# EAGLE design boilup_v1 (EAGLE 8.7.1)
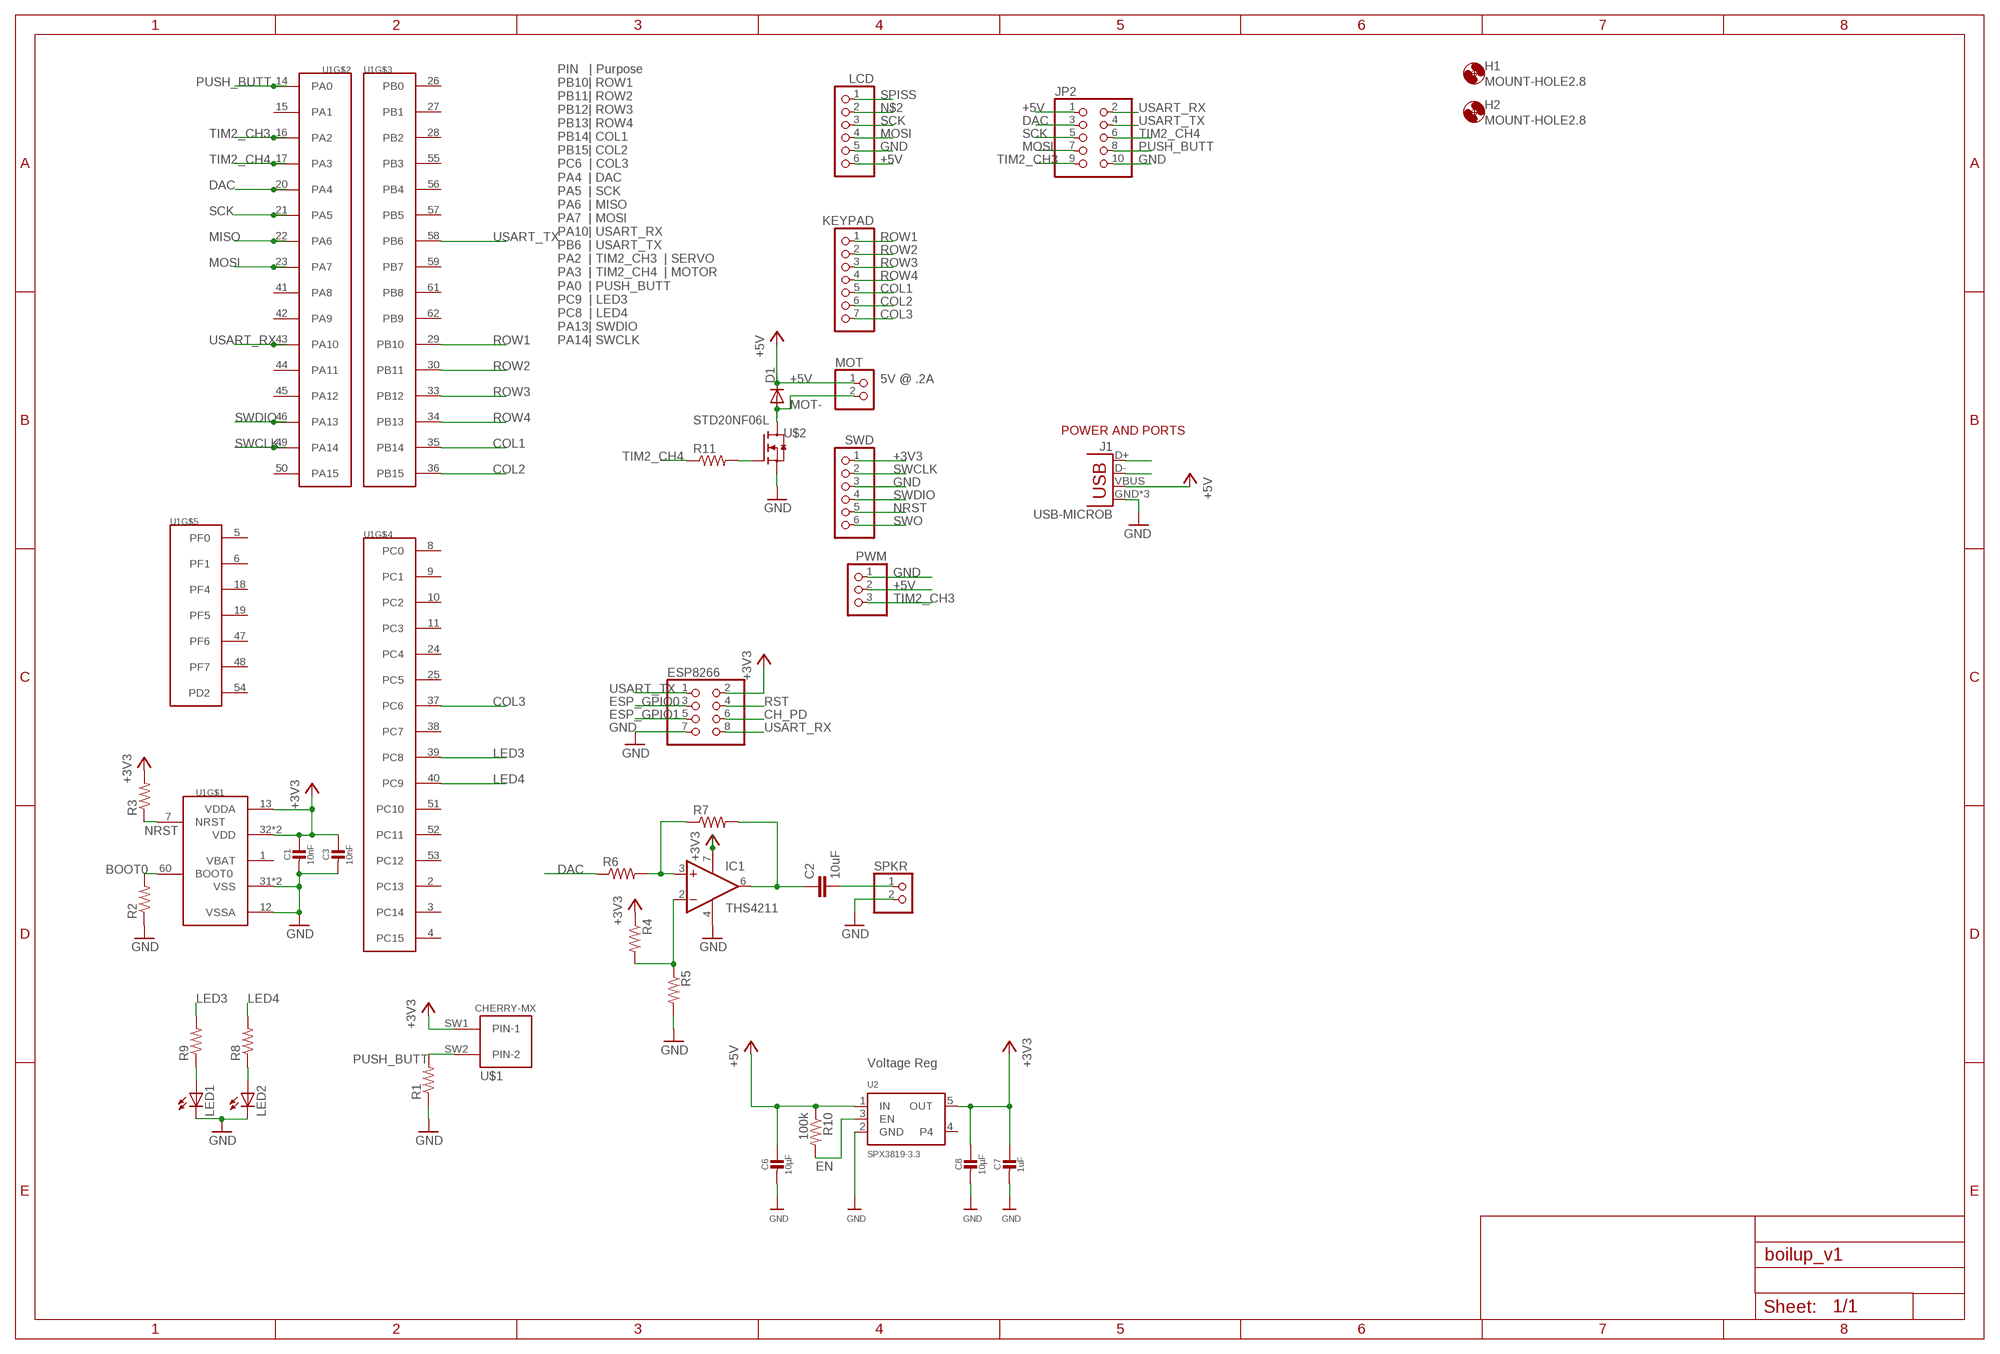
[diagram p0: schematic, sheet 1]

## Parts
C1  10nF  CAP_CERAMIC0805-NOOUTLINE  [0805-NO]
C2  10uF  C-EUC0603K  [C0603K]
C3  10nF  CAP_CERAMIC0805-NOOUTLINE  [0805-NO]
C6  10µF  CAP_CERAMIC0805-NOOUTLINE  [0805-NO]
C7  1uF  CAP_CERAMIC0603_NO  [0603-NO]
C8  10µF  CAP_CERAMIC0805-NOOUTLINE  [0805-NO]
D1  DIODE-DO-214AC  [DO-214AC]
ESP8266  PINHD-2X4  [2X04]
H1  MOUNT-HOLE2.8  [2,8]
H2  MOUNT-HOLE2.8  [2,8]
IC1  THS4211  [S-PDSO-G08]
J1  USB-MICROB  [USB-MICROB]
JP2  PINHD-2X5  [2X05]
KEYPAD  PINHD-1X7  [1X07]
LCD  PINHD-1X6  [1X06]
LED1  LEDSML0805  [SML0805]
LED2  LEDSML0805  [SML0805]
MOT  PINHD-1X2  [1X02]
PWM  PINHD-1X3  [1X03]
R1  R-US_R0603  [R0603]
R2  R-US_R0603  [R0603]
R3  R-US_R0603  [R0603]
R4  R-US_R0603  [R0603]
R5  R-US_R0603  [R0603]
R6  R-US_R0603  [R0603]
R7  R-US_R0603  [R0603]
R8  R-US_R0603  [R0603]
R9  R-US_R0603  [R0603]
R10  100k  R-US_R0603  [R0603]
R11  R-US_R0603  [R0603]
SPKR  PINHD-1X2  [1X02]
SWD  PINHD-1X6  [1X06]
U1  STM32F0_LQFP64  [QFP50P1200X1200X160-64N]
U2  SPX3819-3.3  VREG_SOT23-5  [SOT23-5]
U$1  CHERRY-MX  [CHERRY-MX]
U$2  STD20NF06L  [DPAK]

## Nets
+3V3: C1.1 C3.1 C7.1 C8.1 ESP8266.2 IC1.7(V+) R3.2 R4.1 SWD.1 U1.13(VDDA) U1.32(VDD) U1.64(VDD) U2.5(OUT) U$1.SW1(PIN-1)
+5V: C6.1 D1.C J1.VBUS JP2.1 LCD.6 MOT.1 PWM.2 R10.1 U2.1(IN)
AMP: IC1.3(+IN) R6.2 R7.1
BOOT0: R2.2 U1.60(BOOT0)
CH_PD: ESP8266.6
COL1: KEYPAD.5 U1.35(PB14)
COL2: KEYPAD.6 U1.36(PB15)
COL3: KEYPAD.7 U1.37(PC6)
D+: J1.D+
D-: J1.D-
DAC: JP2.3 R6.1 U1.20(PA4)
EN: R10.2 U2.3(EN)
ESP_GPIO0: ESP8266.3
ESP_GPIO1: ESP8266.5
GND: C1.2 C3.2 C6.2 C7.2 C8.2 ESP8266.7 IC1.4(V-) J1.GND J1.MT1(GND) J1.MT2(GND) JP2.10 LCD.5 LED1.C LED2.C PWM.1 R1.1 R2.1 R5.2 SPKR.2 SWD.3 U1.12(VSSA) U1.31(VSS) U1.63(VSS) U2.2(GND) U$2.P$2(S)
LED3: R9.2 U1.39(PC8)
LED4: R8.2 U1.40(PC9)
MISO: U1.22(PA6)
MOSI: JP2.7 LCD.4 U1.23(PA7)
MOT-: D1.A MOT.2 U$2.P$1(D)
N$1: LED2.A R8.1
N$2: LCD.2
N$3: LED1.A R9.1
N$4: R11.2 U$2.P$3(G)
N$7: IC1.2(-IN) R4.2 R5.1
N$16: C2.2 SPKR.1
N$17: C2.1 IC1.6(OUT) R7.2
NRST: R3.1 SWD.5 U1.7(NRST)
PUSH_BUTT: JP2.8 R1.2 U1.14(PA0) U$1.SW2(PIN-2)
ROW1: KEYPAD.1 U1.29(PB10)
ROW2: KEYPAD.2 U1.30(PB11)
ROW3: KEYPAD.3 U1.33(PB12)
ROW4: KEYPAD.4 U1.34(PB13)
RST: ESP8266.4
SCK: JP2.5 LCD.3 U1.21(PA5)
SPISS: LCD.1
SWCLK: SWD.2 U1.49(PA14)
SWDIO: SWD.4 U1.46(PA13)
SWO: SWD.6
TIM2_CH3: JP2.9 PWM.3 U1.16(PA2)
TIM2_CH4: JP2.6 R11.1 U1.17(PA3)
USART_RX: ESP8266.8 JP2.2 U1.43(PA10)
USART_TX: ESP8266.1 JP2.4 U1.58(PB6)
Unconnected: IC1.TH U1.1(VBAT) U1.2(PC13) U1.3(PC14) U1.4(PC15) U1.5(PF0) U1.6(PF1) U1.8(PC0) U1.9(PC1) U1.10(PC2) U1.11(PC3) U1.15(PA1) U1.18(PF4) U1.19(PF5) U1.24(PC4) U1.25(PC5) U1.26(PB0) U1.27(PB1) U1.28(PB2) U1.38(PC7) U1.41(PA8) U1.42(PA9) U1.44(PA11) U1.45(PA12) U1.47(PF6) U1.48(PF7) U1.50(PA15) U1.51(PC10) U1.52(PC11) U1.53(PC12) U1.54(PD2) U1.55(PB3) U1.56(PB4) U1.57(PB5) U1.59(PB7) U1.61(PB8) U1.62(PB9) U2.4

## Notes on the sheet
- PIN   | Purpose
  PB10| ROW1
  PB11| ROW2
  PB12| ROW3
  PB13| ROW4
  PB14| COL1
  PB15| COL2
  PC6  | COL3
  PA4  | DAC
  PA5  | SCK
  PA6  | MISO
  PA7  | MOSI
  PA10| USART_RX
  PB6  | USART_TX
  PA2  | TIM2_CH3  | SERVO
  PA3  | TIM2_CH4  | MOTOR
  PA0  | PUSH_BUTT
  PC9  | LED3
  PC8  | LED4
  PA13| SWDIO
  PA14| SWCLK
- 5V @ .2A
- POWER AND PORTS
- Voltage Reg

## Library data of the parts
C1 C3 C6-C8 = microbuilder:CAP_CERAMIC: Ceramic Capacitors For new designs, use the packages preceded by an '_' character since they are more reliable: The following footprints should be used on most boards: _0402 - Standard footprint for regular board layouts _0603 - Standard footprint for regular board layouts _0805 - Standard footprint for regular board layouts _1206 - Standard footprint for regular board layouts For extremely tight-pitch boards where space is at a premium, the following 'micro-pitch' footprints can be used (smaller pads, no silkscreen outline, etc.): _0402MP - Micro-pitch footprint for very dense/compact boards _0603MP - Micro-pitch footprint for very dense/compact boards _0805MP - Micro-pitch footprint for very dense/compact boards _1206MP - Micro-pitch footprint for very dense/compact boards
C2 = resistor:C-EU: CAPACITOR, European symbol
D1 = diode:DIODE-: DIODE
ESP8266 = pinhead:PINHD-2X4: PIN HEADER
H1 H2 = holes:MOUNT-HOLE: MOUNTING HOLE with drill center marker
IC1 = texas:THS4211: LOW-DISTORTION, HIGH-SPEED, VOLTAGE FEEDBACK AMPLIFIER Source: http://focus.ti.com/lit/ds/symlink/ths4211.pdf; MF: TEXAS INSTRUMENT CONNECTORS; MPN: THS4211DGK; OC_FARNELL: 8453306; OC_NEWARK: 95H4489
J1 = SparkFun-Connectors:USB: USB Connectors USB-B-PTH is fully proven SKU : PRT-00139/CONN-08278 USB-miniB is fully proven SKU : PRT-00587 USB-A-PCB is untested. USB-A-H is throughly reviewed, but untested. Spark Fun Electronics SKU : PRT-00437 USB-B-SMT is throughly reviewed, but untested. Needs silkscreen touching up. USB-A-S has not been used/tested USB-MB-H has not been used/tested USB-MICROB has been used. CONN-09505; PROD_ID: CONN-09505
JP2 = pinhead:PINHD-2X5: PIN HEADER
KEYPAD = pinhead:PINHD-1X7: PIN HEADER
LCD SWD = pinhead:PINHD-1X6: PIN HEADER
LED1 LED2 = led:LED: LED OSRAM: - CHIPLED LG R971, LG N971, LY N971, LG Q971, LY Q971, LO R971, LY R971 LH N974, LH R974 LS Q976, LO Q976, LY Q976 LO Q996 - Hyper CHIPLED LW Q18S LB Q993, LB Q99A, LB R99A - SideLED LS A670, LO A670, LY A670, LG A670, LP A670 LB A673, LV A673, LT A673, LW A673 LH A674 LY A675 LS A676, LA A676, LO A676, LY A676, LW A676 LS A679, LY A679, LG A679 - Hyper Micro SIDELED® LS Y876, LA Y876, LO Y876, LY Y876 LT Y87S - SmartLED LW L88C, LW L88S LB L89C, LB L89S, LG L890 LS L89K, LO L89K, LY L89K LS L896, LA L896, LO L896, LY L896 - TOPLED LS T670, LO T670, LY T670, LG T670, LP T670 LSG T670, LSP T670, LSY T670, LOP T670, LYG T670 LG T671, LOG T671, LSG T671 LB T673, LV T673, LT T673, LW T673 LH T674 LS T676, LA T676, LO T676, LY T676, LB T676, LH T676, LSB T676, LW T676 LB T67C, LV T67C, LT T67C, LS T67K, LO T67K, LY T67K, LW E67C LS E67B, LA E67B, LO E67B, LY E67B, LB E67C, LV E67C, LT E67C LW T67C LS T679, LY T679, LG T679 LS T770, LO T770, LY T770, LG T770, LP T770 LB T773, LV T773, LT T773, LW T773 LH T774 LS E675, LA E675, LY E675, LS T675 LS T776, LA T776, LO T776, LY T776, LB T776 LHGB T686 LT T68C, LB T68C - Hyper Mini TOPLED® LB M676 - Mini TOPLED Santana® LG M470 LS M47K, LO M47K, LY M47K Source: http://www.osram.convergy.de LUXEON: - LUMILED® LXK2-PW12-R00, LXK2-PW12-S00, LXK2-PW14-U00, LXK2-PW14-V00 LXK2-PM12-R00, LXK2-PM12-S00, LXK2-PM14-U00 LXK2-PE12-Q00, LXK2-PE12-R00, LXK2-PE12-S00, LXK2-PE14-T00, LXK2-PE14-U00 LXK2-PB12-K00, LXK2-PB12-L00, LXK2-PB12-M00, LXK2-PB14-N00, LXK2-PB14-P00, LXK2-PB14-Q00 LXK2-PR12-L00, LXK2-PR12-M00, LXK2-PR14-Q00, LXK2-PR14-R00 LXK2-PD12-Q00, LXK2-PD12-R00, LXK2-PD12-S00 LXK2-PH12-R00, LXK2-PH12-S00 LXK2-PL12-P00, LXK2-PL12-Q00, LXK2-PL12-R00 Source: www.luxeon.com KINGBRIGHT: KA-3528ASYC Source: www.kingbright.com
MOT SPKR = pinhead:PINHD-1X2: PIN HEADER
PWM = pinhead:PINHD-1X3: PIN HEADER
R1-R9 R11 = resistor:R-US_: RESISTOR, American symbol
R10 = adafruit:R-US_: RESISTOR, American symbol
U1 = smarttle:STM32F0_LQFP64
U2 = microbuilder:VREG_SOT23-5: SOT23-5 Fixed Voltage Regulators Part Current Out V Out V In V Dropout θJA (°C/W) TJ (°C) Digikey Part No. ADP121 150mA 3.3V 3.4-5.5V 0.09V @ 150mA -- -- ADP121-AUJZ33R7CT-ND ADP121 150mA 3.0V 3.1-5.5V 0.09V @ 150mA -- -- ADP121-AUJZ30R7CT-ND ADP122 300mA 3.3V 3.4-5.5V 0.085V @ 300mA -- -- ADP122AUJZ-3.3-R7CT-ND ADP1712 300mA 3.3V 3.5-5.5V 0.17V @ 300mA -- -- ADP1712AUJZ-3.3-R7TR-ND AP7311 (Low Cost) 150mA 3.3V 3.5-6V 0.15V @ 150mA -- -- AP7311-33WG-7DICT-ND LD39015M18R 150mA 1.8V 1.9V-5.5V 0.08V @ 100mA -- -- 497-6977-1-ND LP2985A-33DBVR 150mA 3.3V 3.3-16V 0.28V @ 150mA 206 150 296-18479-1-ND MCP1824T-3302E/OT 300mA 3.3V 3.5V-6V 0.2V @ 300mA -- -- MCP1824T-3302E/OTCT-ND MIC5205-2.5YM5 TR 150mA 2.5V 2.7-16V 0.165V @ 150mA -- -- 576-1257-2-ND MIC5205-3.0YM5 TR 150mA 3.0V 3.2V-16V 0.165V @ 150mA -- -- 576-1258-2-ND MIC5205-3.3YM5 TR 150mA 3.3V 3.5V-16V 0.165V @ 150mA -- -- 576-1259-2-ND TPS780330220 150mA 3.3V+2.2V 3.6-5.5V 250mV Max -- -- 296-23332-1-ND TDA3663/N1,135 100mA 3.3V 3.5-45V 0.18V @ 50mA -- -- 568-5343-1-ND Max operating temp can be calculated using θJA, TJ (max junction temperature), and power in watts. Set the "Maximum Ambient Temperature" until it reaches TJ ("Max Junction Temperature"), which is the absolute limit for safe use of the regulator: Heat Sink Temperature Calculator <http://www.daycounter.com/Calculators/Heat-Sink-Temperature-Calculator.phtml> For example, With 12V source into a 3.3V LP2985 and a 30mA load, we are dissipating (12V-3.3V) * 0.03A = 0.261W. With a θJA of 206 °C/W, a TJ of 150°C, and 261mW we can safely use the chip without a heat sink up to 75°C (=147.1°C Junction Temperature).
U$1 = cherrymx:CHERRY-MX: Cherry MX series keyswitch
U$2 = smarttle:STD20NF06L

## Module E
Ports: 

### Library data of the parts

## Board
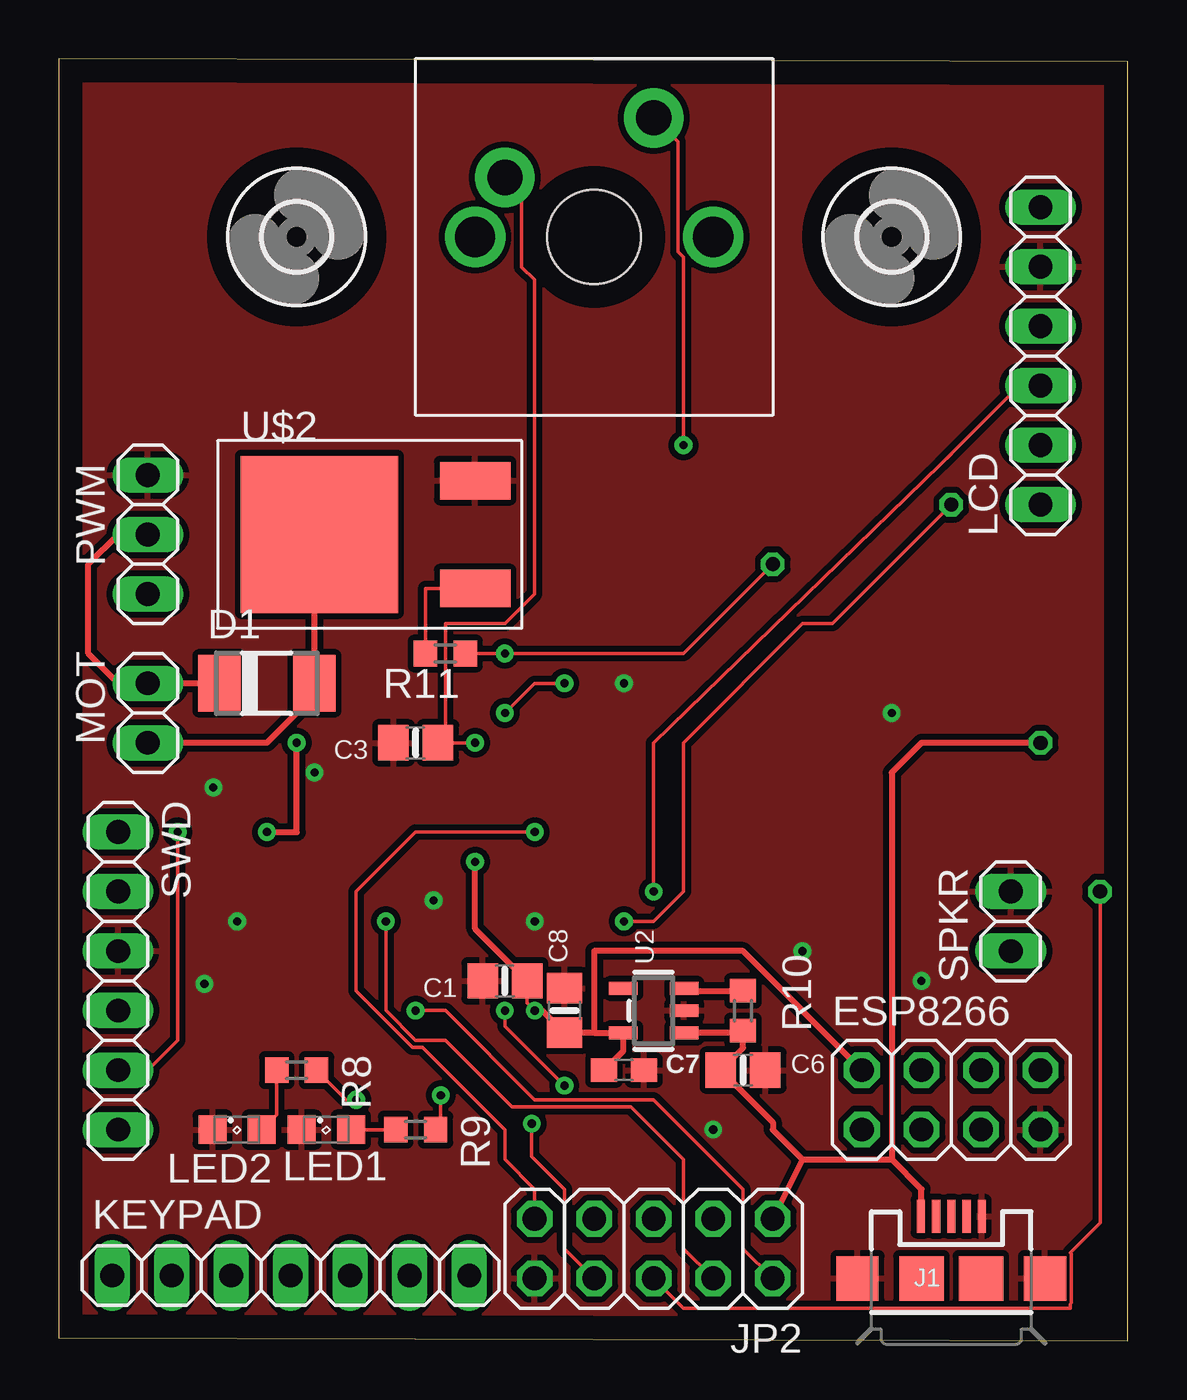
[diagram p1: board, top side]
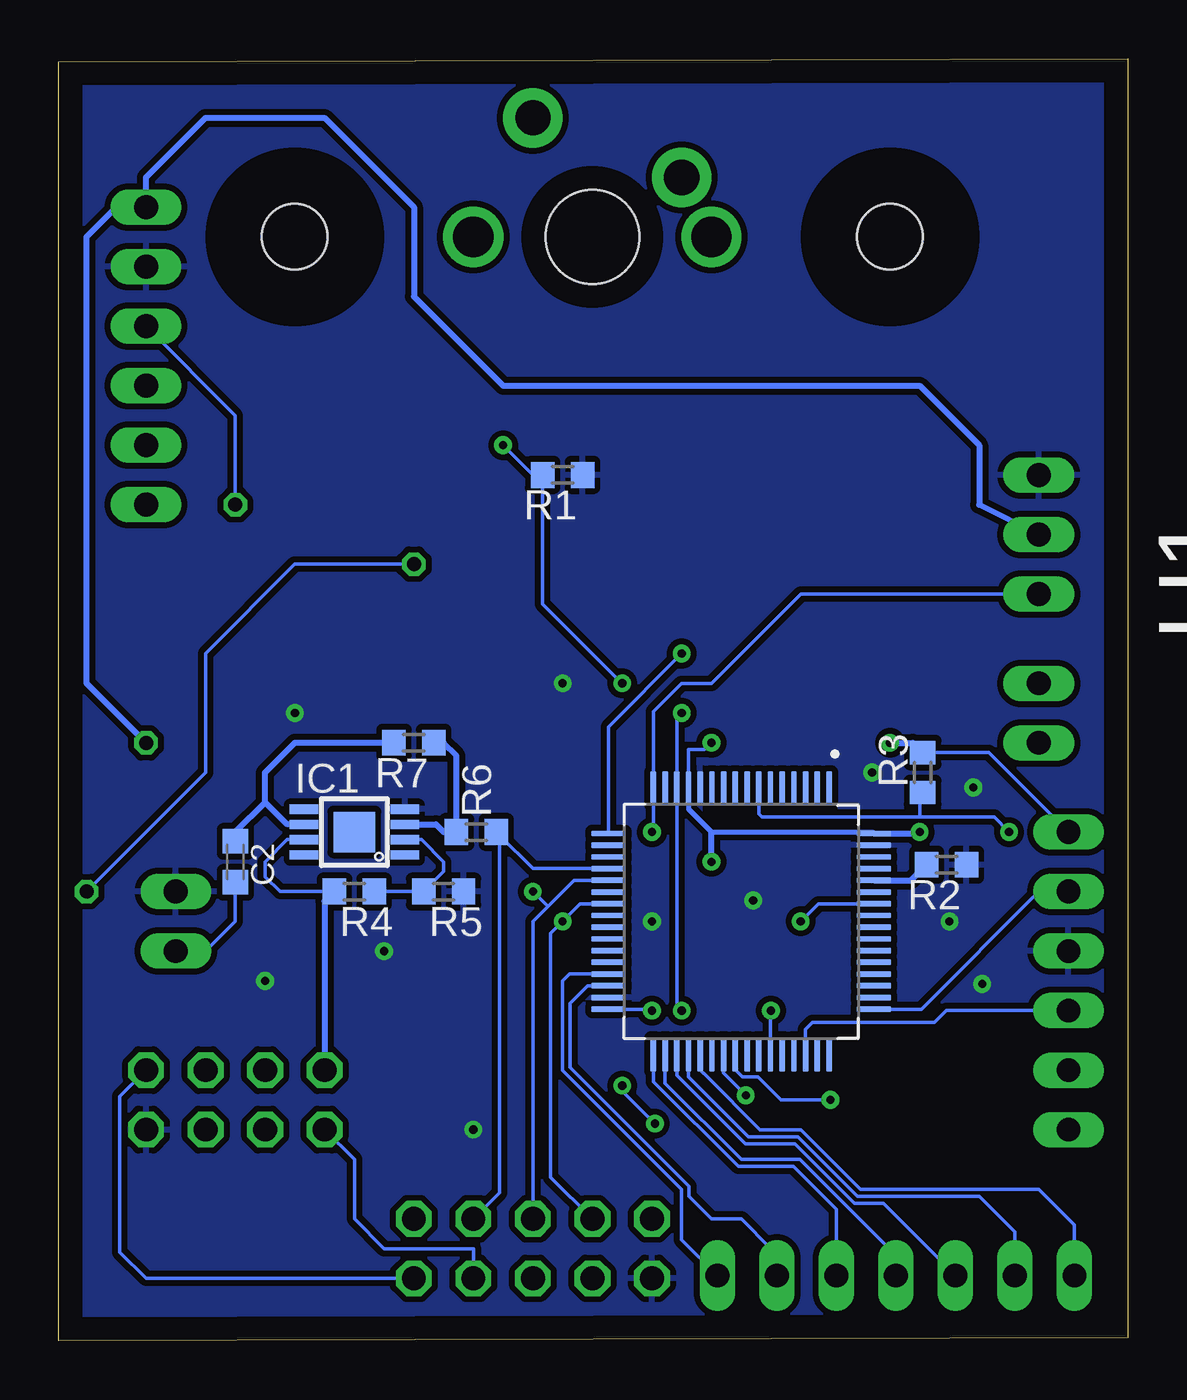
[diagram p2: board, bottom side, seen from below]

Size 45.64 x 54.73 mm. Coordinates in mm from the lower left corner, seen from the top.
Outline: 0,0.13 45.64,0 45.64,54.6 0,54.73 0,0.13
Copper layers (1*16): Top 0.035mm / dielectric 1.5mm / Bottom 0.035mm
Design rules "default": minimum track width 6mil, minimum drill 0.35mm, track to track 6mil, track to pad 6mil, pad to pad 6mil, via to via 6mil, smd to smd 6mil, copper to edge 40mil, drill to drill 6mil, minimum pad ring 10mil, minimum via ring 8mil, stop-mask expansion 4mil, vias tented up to drill 0mil, thermal gap 10mil

### Footprints (pad centres in the part's own frame; a part is rotated, then mirrored left to right if it is on the bottom)
0805-NO = smd 1.3 x 1.5: 1 -0.95,0; 2 0.95,0
C0603K = smd 1.05 x 1.08: 1 -0.875,0; 2 0.875,0
0603-NO = smd 1.1 x 1: 1 -0.85,0; 2 0.85,0
DO-214AC = smd 1.8 x 2.4: A 2.025,0; C -2.025,0
2X04 = drill 1.016 octagon: 1 -3.81,-1.27; 2 -3.81,1.27; 3 -1.27,-1.27; 4 -1.27,1.27; 5 1.27,-1.27; 6 1.27,1.27; 7 3.81,-1.27; 8 3.81,1.27
2,8 = hole 2.8: 0,0
S-PDSO-G08 = smd 0.4 x 1.2: 1 -0.975,-2.157; 2 -0.325,-2.157; 3 0.325,-2.157; 4 0.975,-2.157; 5 0.975,2.157; 6 0.325,2.157; 7 -0.325,2.157; 8 -0.975,2.157 | smd 1.73 x 1.78: TH 0,0
USB-MICROB = smd 0.35 x 1.4: D+ 0,2.65; D- -0.65,2.65; GND 1.3,2.65; ID 0.65,2.65; VBUS -1.3,2.65 | smd 1.8 x 1.9: MT1 -4,0; MT2 4,0 | smd 1.9 x 1.9: P$1 -1.27,0; P$2 1.27,0
2X05 = drill 1.016 octagon: 1 -5.08,-1.27; 2 -5.08,1.27; 3 -2.54,-1.27; 4 -2.54,1.27; 5 0,-1.27; 6 0,1.27; 7 2.54,-1.27; 8 2.54,1.27; 9 5.08,-1.27; 10 5.08,1.27
1X07 = drill 1.016 long: 1 -7.62,0; 2 -5.08,0; 3 -2.54,0; 4 0,0; 5 2.54,0; 6 5.08,0; 7 7.62,0
1X06 = drill 1.016 long: 1 -6.35,0; 2 -3.81,0; 3 -1.27,0; 4 1.27,0; 5 3.81,0; 6 6.35,0
SML0805 = smd 1.2 x 1.2: A 1.05,0; C -1.05,0
1X02 = drill 1.016 long: 1 -1.27,0; 2 1.27,0
1X03 = drill 1.016 long: 1 -2.54,0; 2 0,0; 3 2.54,0
R0603 = smd 1 x 1.1: 1 -0.85,0; 2 0.85,0
QFP50P1200X1200X160-64N = smd 1.47 x 0.25: 1 -5.67,3.75; 2 -5.67,3.25; 3 -5.67,2.75; 4 -5.67,2.25; 5 -5.67,1.75; 6 -5.67,1.25; 7 -5.67,0.75; 8 -5.67,0.25; 9 -5.67,-0.25; 10 -5.67,-0.75; 11 -5.67,-1.25; 12 -5.67,-1.75; 13 -5.67,-2.25; 14 -5.67,-2.75; 15 -5.67,-3.25; 16 -5.67,-3.75; 33 5.67,-3.75; 34 5.67,-3.25; 35 5.67,-2.75; 36 5.67,-2.25; 37 5.67,-1.75; 38 5.67,-1.25; 39 5.67,-0.75; 40 5.67,-0.25; 41 5.67,0.25; 42 5.67,0.75; 43 5.67,1.25; 44 5.67,1.75; 45 5.67,2.25; 46 5.67,2.75; 47 5.67,3.25; 48 5.67,3.75 | smd 0.25 x 1.47: 17 -3.75,-5.67; 18 -3.25,-5.67; 19 -2.75,-5.67; 20 -2.25,-5.67; 21 -1.75,-5.67; 22 -1.25,-5.67; 23 -0.75,-5.67; 24 -0.25,-5.67; 25 0.25,-5.67; 26 0.75,-5.67; 27 1.25,-5.67; 28 1.75,-5.67; 29 2.25,-5.67; 30 2.75,-5.67; 31 3.25,-5.67; 32 3.75,-5.67; 49 3.75,5.67; 50 3.25,5.67; 51 2.75,5.67; 52 2.25,5.67; 53 1.75,5.67; 54 1.25,5.67; 55 0.75,5.67; 56 0.25,5.67; 57 -0.25,5.67; 58 -0.75,5.67; 59 -1.25,5.67; 60 -1.75,5.67; 61 -2.25,5.67; 62 -2.75,5.67; 63 -3.25,5.67; 64 -3.75,5.67
SOT23-5 = smd 0.55 x 1.2: 1 -0.95,-1.3; 2 0,-1.3; 3 0.95,-1.3; 4 0.95,1.3; 5 -0.95,1.3
CHERRY-MX = drill 1.714 pad 1.93: P$3 -5.08,0; P$4 5.08,0 | drill 1.5 pad 2.54: SW1 -3.81,2.54; SW2 2.54,5.08 | hole 4: 0,0
DPAK = smd 6.7 x 6.7: P$1 -6.65,0 | smd 3 x 1.6: P$2 0,2.3; P$3 0,-2.3

### Placement (x,y rotation side)
C1  19.05,15.37 180 top
C2  38.1,20.45 270 bottom
C3  15.24,25.53 180 top
C6  29.21,11.56 0 top
C7  24.13,11.56 0 top
C8  21.59,14.1 90 top
D1  8.89,28.07 0 top
ESP8266  38.1,10.29 0 top
H1  35.56,47.12 0 top
H2  10.16,47.12 0 top
IC1  33.02,21.72 90 bottom
J1  38.1,2.67 0 top
JP2  25.4,3.94 180 top
KEYPAD  9.91,2.79 180 top
LCD  41.91,42.04 90 top
LED1  11.43,9.02 0 top
LED2  7.62,9.02 0 top
MOT  3.81,26.8 270 top
PWM  3.81,34.42 270 top
R1  24.13,36.96 180 bottom
R2  7.75,20.32 180 bottom
R3  8.76,24.26 90 bottom
R4  33.02,19.18 0 bottom
R5  29.21,19.18 0 bottom
R6  27.81,21.72 180 bottom
R7  30.48,25.53 180 bottom
R8  10.16,11.56 0 top
R9  15.24,9.02 0 top
R10  29.21,14.1 90 top
R11  16.51,29.34 180 top
SPKR  40.64,17.91 90 top
SWD  2.54,15.37 270 top
U1  16.51,17.91 270 bottom
U2  25.4,14.1 90 top
U$1  22.86,47.12 0 top
U$2  17.78,34.42 0 top

### Tracks (layer width: path | path; a pad name or v marks a point on that pad's centre or on a via)
+3V3  (via drill 0.35)
  Top 0.152: v17.78,25.53 C3.1 16.51,25.85 16.51,30.61 19.05,30.61 20.32,31.88 20.32,38.23 | C1.1 20,14.42 v20.32,14.1 | 20.32,38.23 20.32,39.5 | 20.32,38.23 20.32,45.28 19.77,45.84 19.77,48.94 U$1.SW1
  Top 0.254: C7.1 24.1,12.38 U2.5 22.86,13.15 | 22.86,13.15 C8.1 20.64,14.1 v20.32,14.1 | ESP8266.2 29.21,16.64 22.86,16.64 22.86,13.15 | C1.1 17.78,17.59 v17.78,20.45 | v8.89,21.72 10.16,21.72 v10.16,25.53
  Bottom 0.152: IC1.7 35.88,21.39 36.83,20.45 36.83,19.81 36.2,19.18 R4.1 | SWD.1 5.93,25.11 R3.2 | U1.13 18.76,25.24 18.07,25.24 v17.78,25.53 | U1.32 20.38,14.16 v20.32,14.1
  Bottom 0.203: U1.64 10.9,21.72 17.78,21.72 18.76,22.7 U1.13
  Bottom 0.254: R4.1 34.29,18.76 ESP8266.2 | v17.78,20.45 17.78,21.72 | U1.64 8.95,21.66 v8.89,21.72 | v10.16,25.53 9.18,25.53 R3.2
+5V  (via drill 0.6)
  Top 0.254: U2.1 29.11,13.15 R10.1 29.21,12.51 C6.1 30.48,9.34 30.48,9.02 31.75,7.75 | J1.VBUS 36.83,5.35 36.83,6.48 35.56,7.75 | 31.75,7.75 JP2.1 | 31.75,7.75 35.56,7.75 | D1.C MOT.1 2.54,28.07 1.27,29.34 1.27,33.15 2.54,34.42 PWM.2 | 35.56,7.75 35.56,24.26 36.83,25.53 v41.91,25.53
  Bottom 0.254: PWM.2 6.35,35.69 6.35,38.23 8.89,40.77 26.67,40.77 30.48,44.58 30.48,48.39 34.29,52.2 39.37,52.2 41.91,49.66 LCD.6 43.18,48.39 44.45,47.12 44.45,28.07 v41.91,25.53
AMP
  Bottom 0.254: IC1.3 29.54,22.04 29.21,21.72 R6.2 28.66,24.98 29.21,25.53 R7.1
BOOT0
  Bottom 0.254: U1.60 9.26,19.66 R2.2
COL1
  Bottom 0.152: KEYPAD.5 10.44,5.87 11.68,5.87 14.22,8.41 16.33,8.41 19.26,11.34 U1.35
COL2
  Bottom 0.152: U1.36 18.76,11.27 16.2,8.71 14.1,8.71 11.56,6.17 6.35,6.17 4.83,4.65 KEYPAD.6
COL3
  Bottom 0.152: 18.01,11.33 18.11,11.43 | 18.01,11.33 15.71,9.02 13.97,9.02 11.43,6.48 3.81,6.48 2.29,4.95 KEYPAD.7 | U1.37 18.26,11.57 18.01,11.33
DAC
  Bottom 0.152: U1.20 25.4,20.16 26.82,21.57 | 26.82,21.57 R6.1 | JP2.3 26.82,6.33 26.82,21.57
EN
  Top 0.254: U2.3 26.8,14.95 R10.2
GND  (via drill 0.35)
  other vias: 7.62,17.91 6.6,23.62 10.92,24.26 16,18.8 6.22,15.24 27.94,9.02 20.32,17.91 31.75,16.64 36.83,15.37 35.56,26.8 24.13,28.07
  pour Top (isolate 0.254): 0,0.13 46.99,0.13 46.99,56.01 0,56.01
  pour Bottom (isolate 0.254): 0,0.13 0,56.01 49.53,56.01 49.53,0.13
LED3  (via drill 0.35)
  Top 0.152: v16.31,10.48 16.31,9.02 R9.2
  Bottom 0.152: U1.39 17.26,11.43 v16.31,10.48
LED4  (via drill 0.35)
  Top 0.152: v12.7,10.29 12.28,10.29 R8.2
  Bottom 0.152: v12.7,10.29 14.81,10.29 15.8,11.27 16.46,11.27 16.76,11.57 U1.40
MOSI  (via drill 0.35, 0.6)
  Top 0.152: v24.13,17.91 25.4,17.91 26.67,19.18 26.67,25.53 31.75,30.61 33.02,30.61 v38.1,35.69
  Bottom 0.152: JP2.7 24.64,6.98 24.64,17.4 v24.13,17.91 23.38,18.66 U1.23 | v38.1,35.69 38.1,39.5 LCD.4
MOT-
  Top 0.254: U$2.P$1 arc-90 10.91,33.36 D1.A 10.91,27.55 8.89,25.53 MOT.2
N$1
  Top 0.152: R8.1 9.31,9.66 LED2.A
N$3
  Top 0.152: R9.1 LED1.A
N$4
  Top 0.152: R11.2 15.66,32.12 U$2.P$3
N$7
  Bottom 0.152: R4.2 R5.1 29.21,20.03 29.21,20.45 30.16,21.39 IC1.2
N$16
  Bottom 0.152: C2.2 38.1,17.91 39.37,16.64 SPKR.1
N$17
  Bottom 0.254: R7.2 35.56,25.53 36.83,24.26 36.83,22.99 | IC1.6 35.88,22.04 36.83,22.99 | C2.1 38.1,21.72 36.83,22.99
NRST  (via drill 0.35)
  Top 0.152: v5.08,21.72 5.08,12.83 3.81,11.56
  Top 0.203: 3.81,11.56 SWD.5
  Bottom 0.152: U1.7 15.76,22.49 15.62,22.35 8.89,22.35 | 8.89,22.35 5.71,22.35 v5.08,21.72 | 8.89,22.99 8.89,22.35
  Bottom 0.203: R3.1 8.89,22.99
PUSH_BUTT  (via drill 0.35)
  Top 0.152: v19.05,14.1 19.05,13.43 v21.59,10.89 | v20.19,9.27 20.19,7.87 21.59,6.48 21.59,3.94 JP2.8 | v19.05,26.8 20.32,28.07 v21.59,28.07 | v26.67,38.23 26.67,46.25 26.43,46.49 26.43,51.17 U$1.SW2
  Bottom 0.152: v19.05,14.1 19.26,14.31 U1.14 19.26,26.59 v19.05,26.8 | v21.59,10.89 21.59,10.67 v20.19,9.27 | v21.59,28.07 24.98,31.46 R1.2 25.4,36.96 v26.67,38.23
ROW1
  Bottom 0.152: KEYPAD.1 19.05,4.32 19.05,6.48 24.13,11.56 24.13,15.37 23.84,15.66 U1.29
ROW2
  Bottom 0.152: U1.30 23.07,15.16 23.82,14.4 23.82,11.68 18.75,6.6 18.75,6.17 17.78,5.21 16.51,5.21 15.24,3.94 15.24,3.05 KEYPAD.2
ROW3
  Bottom 0.152: U1.33 20.26,11.07 16.64,7.44 14.28,7.44 12.45,5.61 KEYPAD.3
ROW4
  Bottom 0.152: U1.34 19.76,11 16.51,7.75 13.99,7.75 9.91,3.66 KEYPAD.4
SCK  (via drill 0.35)
  Top 0.152: v25.4,19.18 25.4,25.53 37.66,37.41 | 37.66,37.41 38.1,37.85 | LCD.3 41.01,40.77 37.66,37.41
  Bottom 0.152: JP2.5 25.4,17.91 24.77,18.54 | 24.77,18.54 23.65,19.66 U1.21 | v25.4,19.18 24.77,18.54
SWCLK
  Bottom 0.152: U1.49 8.83,14.16 3.81,19.18 SWD.2
SWDIO
  Bottom 0.152: SWD.4 7.75,14.1 8.26,13.59 13.46,13.59 13.76,13.29 U1.46
TIM2_CH3  (via drill 0.35)
  Top 0.152: JP2.9 20.32,6.48 19.05,7.75 19.05,9.02 15.54,12.52 15.11,12.52 12.7,14.94 12.7,19.18 15.24,21.72 v20.32,21.72
  Bottom 0.152: PWM.3 13.97,31.88 17.78,28.07 19.05,28.07 20.26,26.86 U1.16 20.26,21.78 v20.32,21.72
TIM2_CH4  (via drill 0.35, 0.6)
  Top 0.152: R11.1 v19.05,29.34 26.67,29.34 v30.48,33.15 | JP2.6 26.67,1.4 43.18,1.4 43.18,1.57 43.23,1.62 43.23,3.71 43.18,3.76 44.45,5.03 v44.45,19.18
  Bottom 0.152: U1.17 22.18,26.21 v19.05,29.34 | v30.48,33.15 35.56,33.15 39.37,29.34 39.37,24.26 v44.45,19.18
USART_RX  (via drill 0.35)
  Top 0.152: JP2.2 29.21,3.94 29.21,6.48 25.4,10.29 20.32,10.29 16.51,14.1 v15.24,14.1
  Bottom 0.152: ESP8266.8 43.03,10.44 43.03,3.79 41.91,2.67 JP2.2 | v15.24,14.1 15.26,14.08 U1.43
USART_TX  (via drill 0.35)
  Top 0.152: JP2.4 26.67,3.94 26.67,7.75 24.43,9.98 19.36,9.98 16.51,12.83 15.24,12.83 13.97,14.1 v13.97,17.91
  Bottom 0.152: ESP8266.1 33.02,7.75 33.02,5.21 31.75,3.94 27.94,3.94 JP2.4 | v13.97,17.91 13.22,18.66 U1.58